# Altium project CAN Termination.PrjPCB
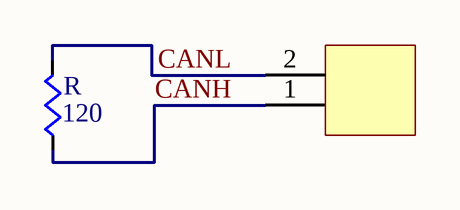
[diagram p0: CAN Termination.SchDoc]
1 sheet, 2 parts. Net scope: global (net labels, ports and power ports of the same name join across sheets).
Board file: CAN Termination.PcbDoc

## Sheet CAN Termination.SchDoc
size A

### Parts
R  value 120  [RES0603]  (hidden comment: Res)
  2-pin Horz Sherlock  [MOLEX-HDR-1X2-SHERLOCK-HORZ]  (value not drawn)

### Nets
CANH: R.2(B) .1
CANL: R.1(A) .2

### Library data of the parts
 = MOLEX-HDR-1x2-SHERLOCK_RA: Header, Molex, 2mm Pitch Sherlock Header, Single Row, Horizontal, 2 Circuits, Length 3.3mm,  0353630260; Manufacturer: Molex Inc